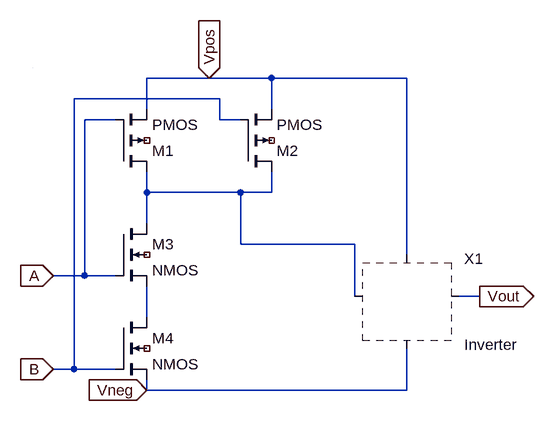
[diagram p0: schematic CMOS_AND.asc]
CMOS_AND.asc, the LTspice schematic file:
Version 4
SHEET 1 880 680
WIRE 272 16 176 16
WIRE 368 16 272 16
WIRE 576 16 368 16
WIRE 288 48 64 48
WIRE 176 64 176 16
WIRE 368 64 368 16
WIRE 128 80 80 80
WIRE 288 80 288 48
WIRE 320 80 288 80
WIRE 176 192 176 160
WIRE 320 192 176 192
WIRE 368 192 368 160
WIRE 368 192 320 192
WIRE 176 240 176 192
WIRE 320 272 320 192
WIRE 496 272 320 272
WIRE 576 288 576 16
WIRE 80 320 80 80
WIRE 80 320 32 320
WIRE 128 320 80 320
WIRE 496 352 496 272
WIRE 688 352 656 352
WIRE 176 384 176 336
WIRE 64 464 64 48
WIRE 64 464 32 464
WIRE 128 464 64 464
WIRE 176 496 176 480
WIRE 576 496 576 432
WIRE 576 496 176 496
WIRE 0 0 0 0
FLAG 32 320 A
IOPIN 32 320 In
FLAG 32 464 B
IOPIN 32 464 In
FLAG 272 16 Vpos
IOPIN 272 16 In
FLAG 176 496 Vneg
IOPIN 176 496 In
FLAG 688 352 Vout
IOPIN 688 352 Out
SYMBOL pmos4 128 160 M180
SYMATTR InstName M1
SYMBOL pmos4 320 160 M180
SYMATTR InstName M2
SYMBOL nmos4 128 240 R0
SYMATTR InstName M3
SYMBOL nmos4 128 384 R0
SYMATTR InstName M4
SYMBOL HW5\\Inverter 560 352 R0
SYMATTR InstName X1

The netlist it stands for:
* CMOS_AND.asc
M1 N001 A Vpos NC_01 PMOS
M2 N001 B Vpos NC_02 PMOS
M3 N001 A N002 NC_03 NMOS
M4 N002 B Vneg NC_04 NMOS
* X1: Inverter (symbol HW5\Inverter not available, pin order unknown); nets seen at it: N001, Vneg, Vout, Vpos
.model NMOS NMOS
.model PMOS PMOS
.lib standard.mos
.backanno
.end